# Altium schematic sheet Encoders.SchDoc
size A; SheetNumber: 4; SheetTotal: 4
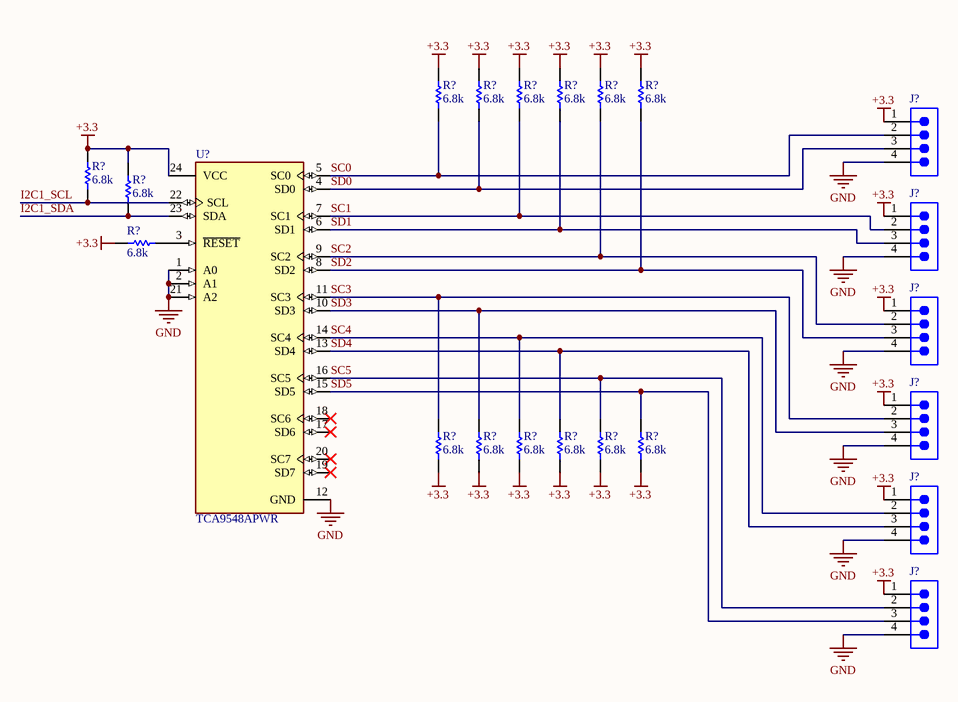
[diagram p0: Encoders.SchDoc]

## Parts
(Parts that share a designator on the sheet are numbered #1, #2 ... from top to bottom, then left to right.)
J?#1  61300411121  [61300411121]  (value not drawn)
J?#2  61300411121  [61300411121]  (value not drawn)
J?#3  61300411121  [61300411121]  (value not drawn)
J?#4  61300411121  [61300411121]  (value not drawn)
J?#5  61300411121  [61300411121]  (value not drawn)
J?#6  61300411121  [61300411121]  (value not drawn)
R?#1  value 6.8k  [RESC1609X50X30LL10T20]  (hidden comment: CRCW06036K80FKEA)
R?#2  value 6.8k  [RESC1609X50X30LL10T20]  (hidden comment: CRCW06036K80FKEA)
R?#3  value 6.8k  [RESC1609X50X30LL10T20]  (hidden comment: CRCW06036K80FKEA)
R?#4  value 6.8k  [RESC1609X50X30LL10T20]  (hidden comment: CRCW06036K80FKEA)
R?#5  value 6.8k  [RESC1609X50X30LL10T20]  (hidden comment: CRCW06036K80FKEA)
R?#6  value 6.8k  [RESC1609X50X30LL10T20]  (hidden comment: CRCW06036K80FKEA)
R?#7  value 6.8k  [RESC1609X50X30LL10T20]  (hidden comment: CRCW06036K80FKEA)
R?#8  value 6.8k  [RESC1609X50X30LL10T20]  (hidden comment: CRCW06036K80FKEA)
R?#9  value 6.8k  [RESC1609X50X30LL10T20]  (hidden comment: CRCW06036K80FKEA)
R?#10  value 6.8k  [RESC1609X50X30LL10T20]  (hidden comment: CRCW06036K80FKEA)
R?#11  value 6.8k  [RESC1609X50X30LL10T20]  (hidden comment: CRCW06036K80FKEA)
R?#12  value 6.8k  [RESC1609X50X30LL10T20]  (hidden comment: CRCW06036K80FKEA)
R?#13  value 6.8k  [RESC1609X50X30LL10T20]  (hidden comment: CRCW06036K80FKEA)
R?#14  value 6.8k  [RESC1609X50X30LL10T20]  (hidden comment: CRCW06036K80FKEA)
R?#15  value 6.8k  [RESC1609X50X30LL10T20]  (hidden comment: CRCW06036K80FKEA)
U?  TCA9548APWR  [FP-PW0024A-MFG]

## Nets
+3.3: J?#1.1 J?#2.1 J?#3.1 J?#4.1 J?#5.1 J?#6.1 R?#1.2 R?#2.2 R?#3.2 R?#4.2 R?#5.2 R?#6.2 R?#7.2 R?#8.2 R?#9.2 R?#10.1 R?#11.1 R?#12.1 R?#13.1 R?#14.1 R?#15.1 U?.24(VCC)
GND: J?#1.4 J?#2.4 J?#3.4 J?#4.4 J?#5.4 J?#6.4 U?.1(A0) U?.2(A1) U?.12(GND) U?.21(A2)
I2C1_SCL: R?#7.1 U?.22(SCL)
I2C1_SDA: R?#8.1 U?.23(SDA)
SC0: J?#1.2 R?#1.1 U?.5(SC0)
SC1: J?#2.2 R?#3.1 U?.7(SC1)
SC2: J?#3.2 R?#5.1 U?.9(SC2)
SC3: J?#4.2 R?#10.2 U?.11(SC3)
SC4: J?#5.2 R?#12.2 U?.14(SC4)
SC5: J?#6.2 R?#14.2 U?.16(SC5)
SD0: J?#1.3 R?#2.1 U?.4(SD0)
SD1: J?#2.3 R?#4.1 U?.6(SD1)
SD2: J?#3.3 R?#6.1 U?.8(SD2)
SD3: J?#4.3 R?#11.2 U?.10(SD3)
SD4: J?#5.3 R?#13.2 U?.13(SD4)
SD5: J?#6.3 R?#15.2 U?.15(SD5)
NetR?#9_1: R?#9.1 U?.3(~{RESET})

Not connected (* = marked no-connect by the designer): U? 17(SD6)* 18(SC6)* 19(SD7)* 20(SC7)*

## Library data of the parts
J?#1-J?#6 = CMP-1502-01064-3: NexarPartId: 32855522; Operating Supply Voltage: 250V; Pitch: 2.54mm; Contact Resistance: 20mΩ; Number of Positions: 4; Current Rating: 3A; Connector Type: Male Pin; Gender: Male; Contact Plating: Gold; Height: 8.89mm; Lead Pitch: 2.54mm; Lead Free: Lead Free; Contact Mating Length: 5.9944mm; Number of Rows: 1; Termination: Solder; Packaging: Bulk; REACH SVHC: Unknown; Min Operating Temperature: -40°C; RoHS: Compliant; Number of Contacts: 4; Voltage Rating: 250V; Color: Black; Max Operating Temperature: 105°C; Contact Material: Copper; Mount: Through Hole; Orientation: Vertical; Number of Pins: 4
R?#1-R?#15 = CMP-2000-03550-1: Manufacturer: Vishay Dale; Part Number: CRCW06036K80FKEA; LCSC: C269697
U? = CMP-04892-000002-1: IC I2C SW 8CH W/RESET 24TSSOP; Manufacturer: Texas Instruments; Number Of Circuits: 1; Mux Demux Ratio: 1:8; Nominal Supply Current: 2-50uA; Interface: I2C,SMBus; Min Supply Voltage: 1.65V; Standoff Height: 0.05mm; Description: Bus Switch 1 x 8:1 24-TSSOP; Max Supply Voltage: 5.5V; Device Class L2: Interface ICs; ComponentLink2Description: Datasheet; Ipc Land Pattern Name: SOP65P640X120-24; Category: IC; Device Class L1: Integrated Circuits (ICs); Manufacturer Part Number: TCA9548APWR; RoHS: TRUE; Temperature Range High: +85°C; Digikey Description: IC I2C SW 8CH W/RESET 24TSSOP; Temperature Range Low: -40°C; Lead Free: Yes; Package: PW0024A; ComponentLink2URL: http://www.ti.com/lit/ds/symlink/tca9548a.pdf; Device Class L3: Multiplexers; Ambient Temperature Range Low: -40°C; Mouser Description: Low-Voltage 8-Channel I2C Switch With Reset 24-TSSOP -40 to 85; Temperature: -40°C to +85°C; Octopart: https://octopart.com/tca9548apwr-texas+instruments-22266789; Ambient Temperature Range High: +85°C; Automotive: No; Height: 1.2mm